# Altium schematic sheet interface.SchDoc
size A3; DocumentNumber: 3; SheetTotal: 4
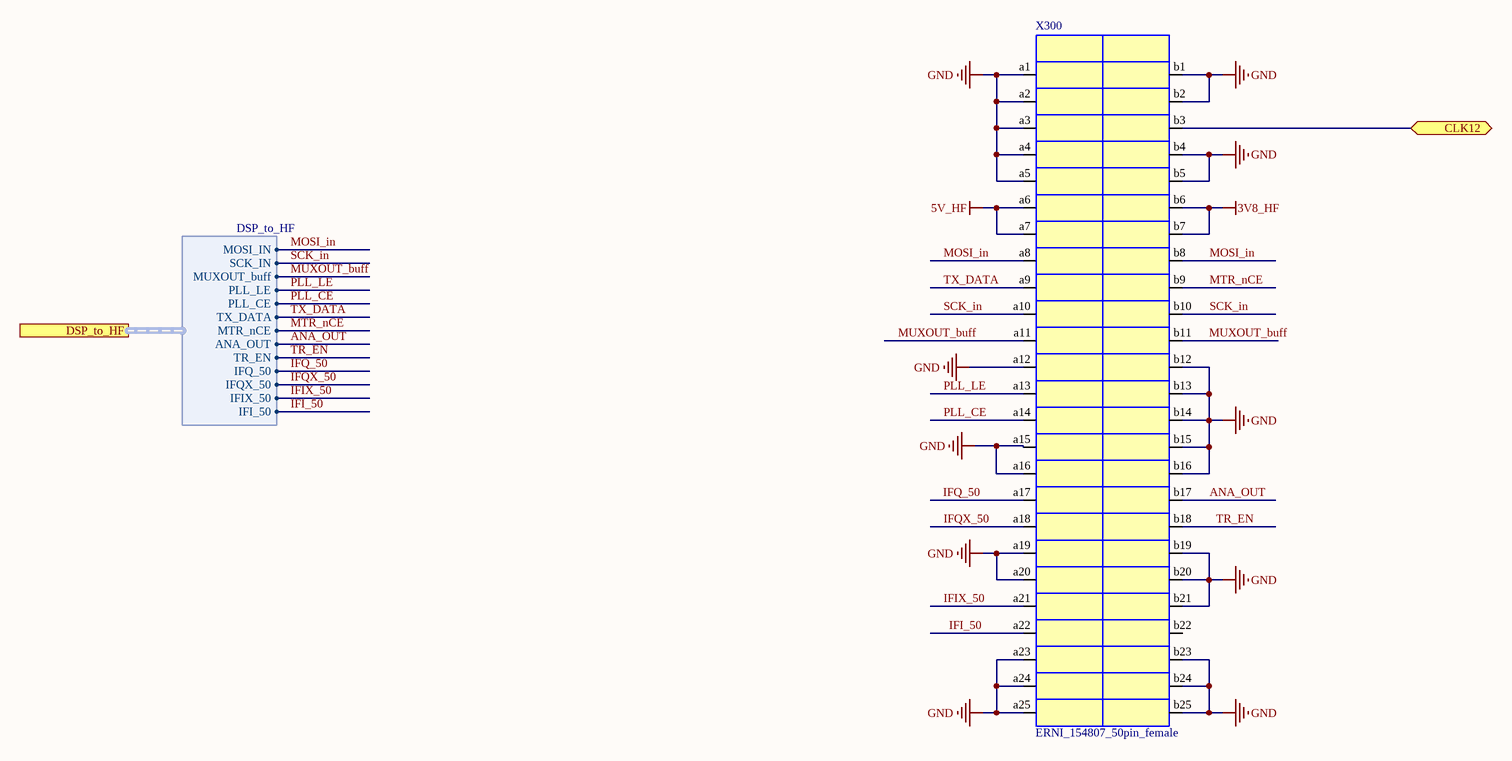
[diagram p0: interface.SchDoc]

## Parts
X300  ERNI_154807_50pin_female  [ERNI_SMC_50_PINM]

## Ports
CLK12 (bidir), DSP_to_HF (harness DSP_to_HF)

## Harnesses
DSP_to_HF: MOSI_IN, SCK_IN, MUXOUT_buff, PLL_LE, PLL_CE, TX_DATA, MTR_nCE, ANA_OUT, TR_EN, IFQ_50, IFQX_50, IFIX_50, IFI_50

## Nets
3V8_HF: X300.b6 X300.b7
5V_HF: X300.a6 X300.a7
GND: X300.a1 X300.a2 X300.a3 X300.a4 X300.a5 X300.a12 X300.a15 X300.a16 X300.a19 X300.a20 X300.a23 X300.a24 X300.a25 X300.b1 X300.b2 X300.b4 X300.b5 X300.b12 X300.b13 X300.b14 X300.b15 X300.b16 X300.b19 X300.b20 X300.b21 X300.b23 X300.b24 X300.b25
ANA_OUT: X300.b17 ; port DSP_to_HF.ANA_OUT
CLK12: X300.b3 ; port CLK12
IFI_50: X300.a22 ; port DSP_to_HF.IFI_50
IFIX_50: X300.a21 ; port DSP_to_HF.IFIX_50
IFQ_50: X300.a17 ; port DSP_to_HF.IFQ_50
IFQX_50: X300.a18 ; port DSP_to_HF.IFQX_50
MOSI_in: X300.a8 X300.b8 ; port DSP_to_HF.MOSI_IN
MTR_nCE: X300.b9 ; port DSP_to_HF.MTR_nCE
MUXOUT_buff: X300.a11 X300.b11 ; port DSP_to_HF.MUXOUT_buff
PLL_CE: X300.a14 ; port DSP_to_HF.PLL_CE
PLL_LE: X300.a13 ; port DSP_to_HF.PLL_LE
SCK_in: X300.a10 X300.b10 ; port DSP_to_HF.SCK_IN
TR_EN: X300.b18 ; port DSP_to_HF.TR_EN
TX_DATA: X300.a9 ; port DSP_to_HF.TX_DATA

Not connected (* = marked no-connect by the designer): X300 b22